# EAGLE design untitled B (EAGLE 6.2)
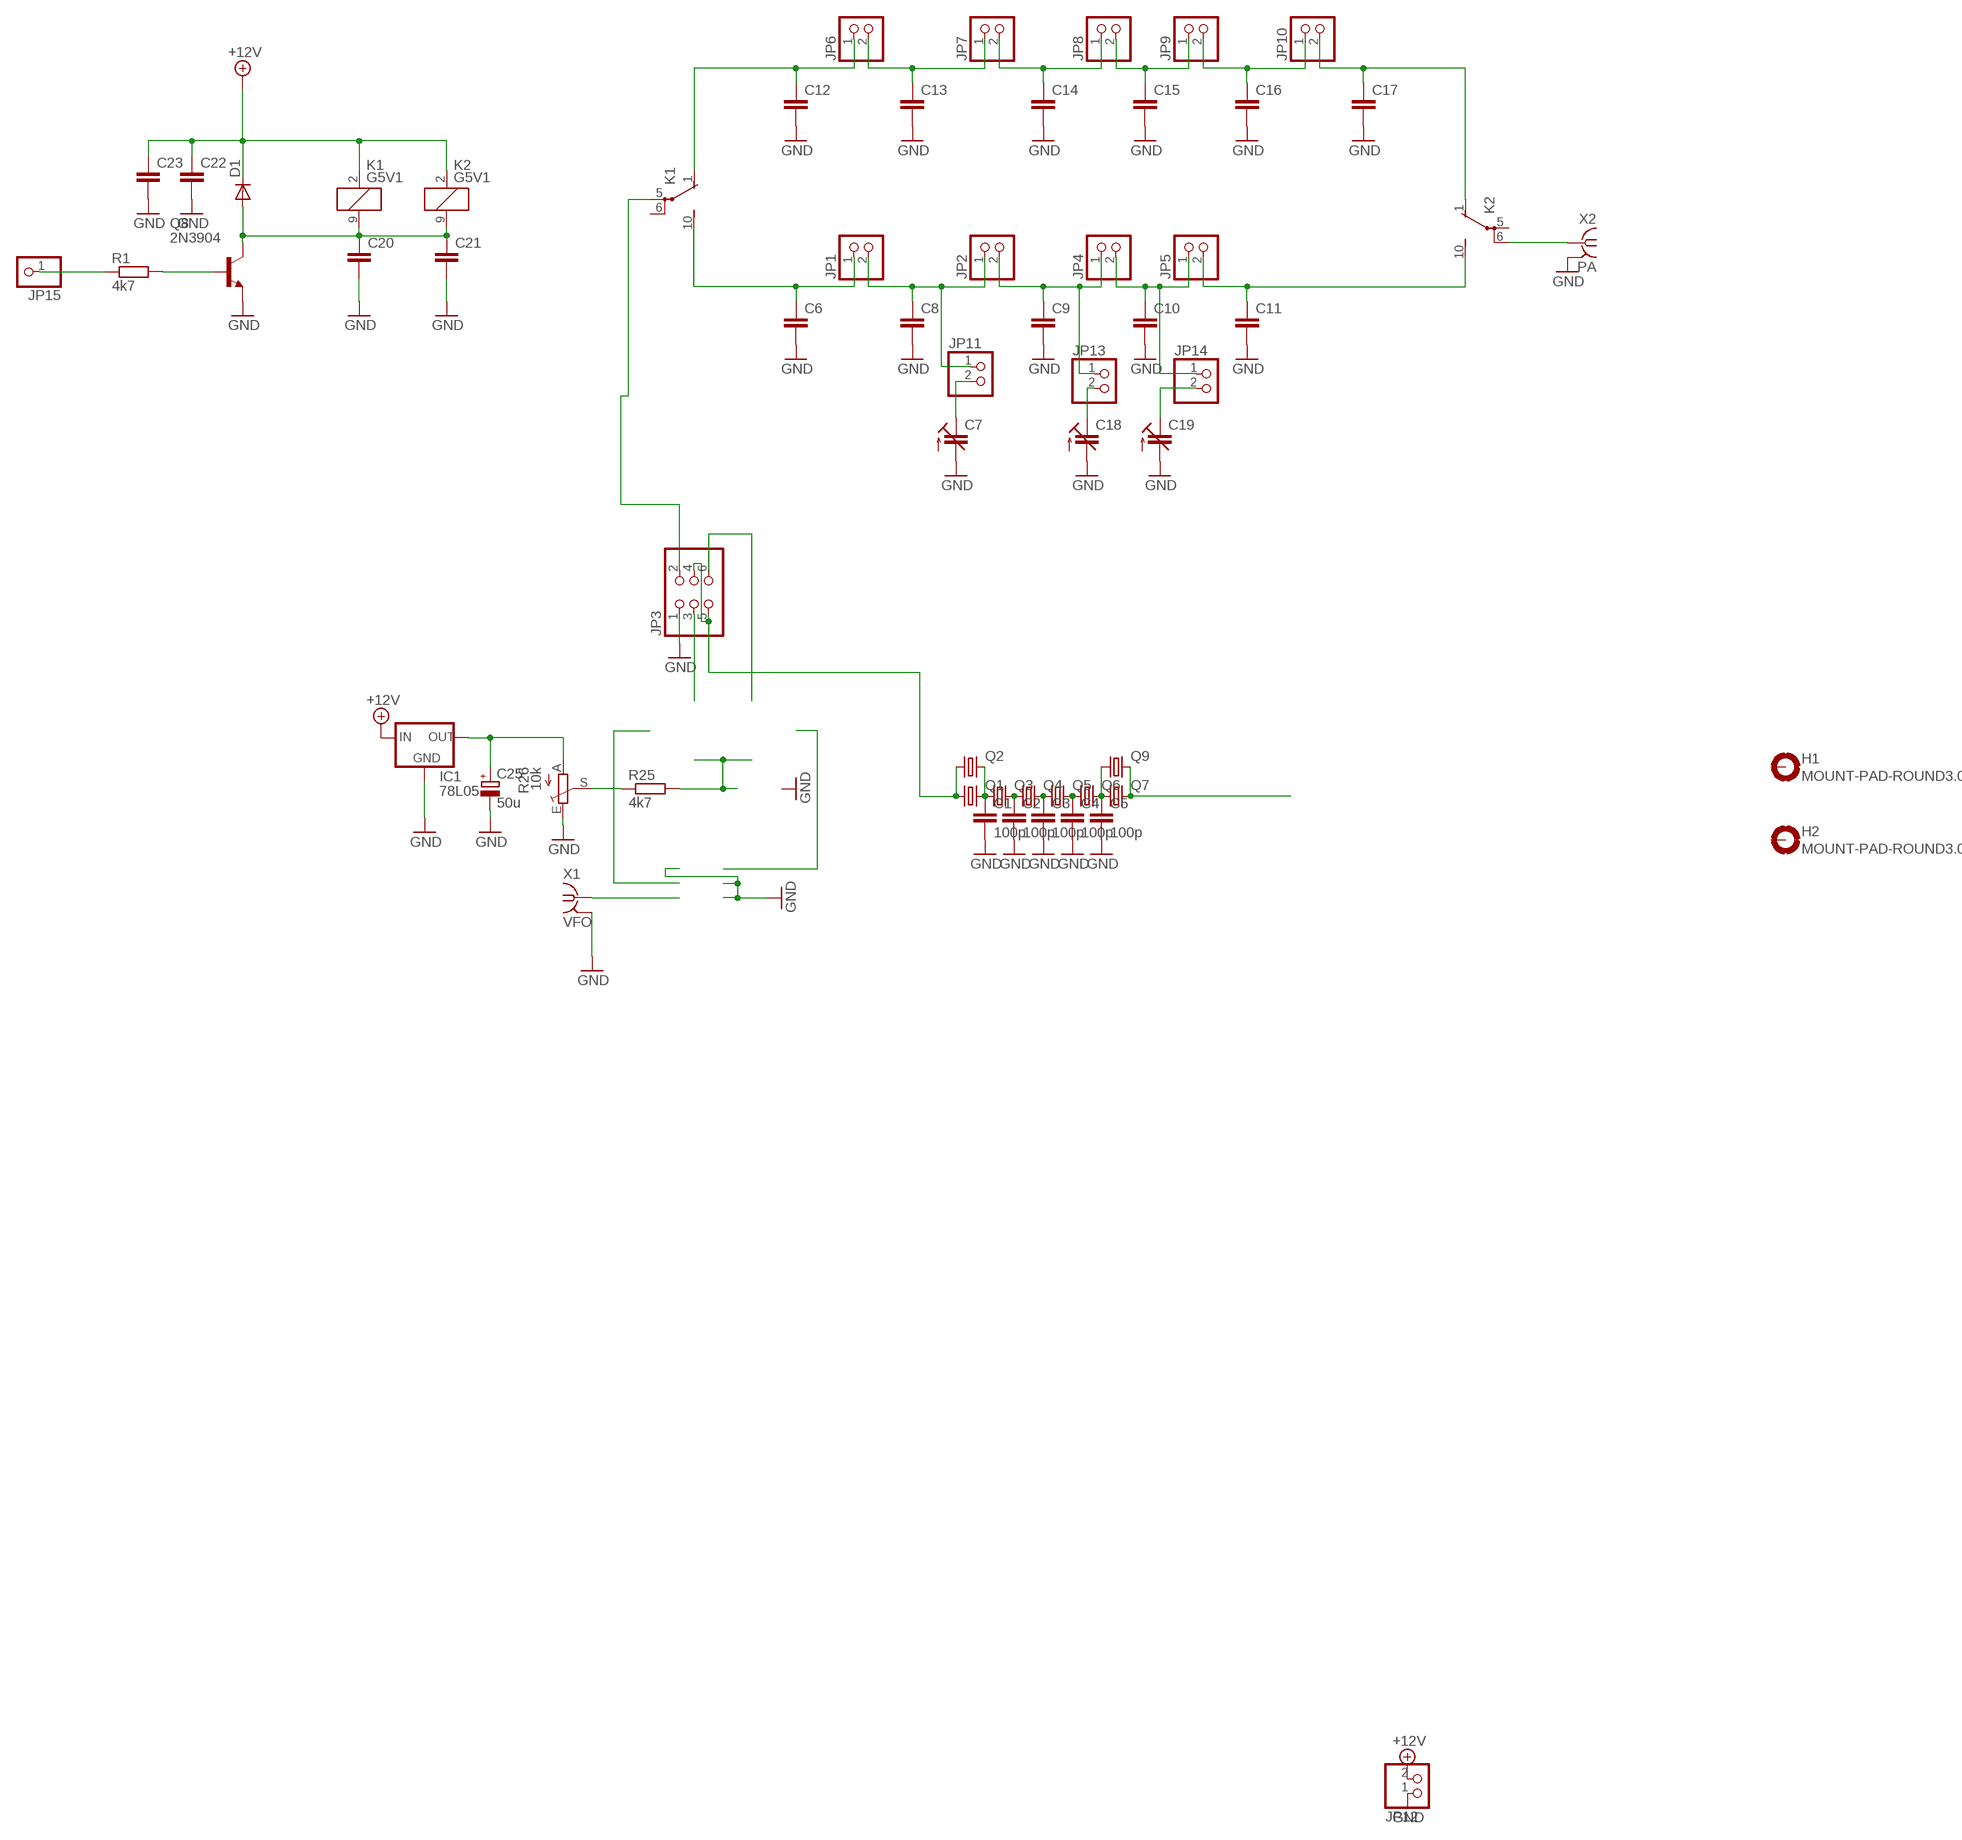
[diagram p0: schematic, sheet 1]

## Parts
C1  100p  C-EUC1206  [C1206]
C2  100p  C-EUC1206  [C1206]
C3  100p  C-EUC1206  [C1206]
C4  100p  C-EUC1206  [C1206]
C5  100p  C-EUC1206  [C1206]
C6  C-EU050-024X044  [C050-024X044]
C7  C-TRIMMTZ03  [CTRIMTZ03]
C8  C-EU050-024X044  [C050-024X044]
C9  C-EU050-024X044  [C050-024X044]
C10  C-EU050-024X044  [C050-024X044]
C11  C-EU050-024X044  [C050-024X044]
C12  C-EU050-024X044  [C050-024X044]
C13  C-EU050-024X044  [C050-024X044]
C14  C-EU050-024X044  [C050-024X044]
C15  C-EU050-024X044  [C050-024X044]
C16  C-EU050-024X044  [C050-024X044]
C17  C-EU050-024X044  [C050-024X044]
C18  C-TRIMMTZ03  [CTRIMTZ03]
C19  C-TRIMMTZ03  [CTRIMTZ03]
C20  C-EU050-024X044  [C050-024X044]
C21  C-EU050-024X044  [C050-024X044]
C22  C-EU050-024X044  [C050-024X044]
C23  C-EU050-024X044  [C050-024X044]
C25  50u  CPOL-EUE2.5-5  [E2,5-5]
D1  DIODE-D-5  [D-5]
H1  MOUNT-PAD-ROUND3.0  [3,0-PAD]
H2  MOUNT-PAD-ROUND3.0  [3,0-PAD]
IC1  78L05  78LXX  [78LXX]
JP1  PINHD-1X2  [1X02]
JP2  PINHD-1X2  [1X02]
JP3  PINHD-2X3  [2X03]
JP4  PINHD-1X2  [1X02]
JP5  PINHD-1X2  [1X02]
JP6  PINHD-1X2  [1X02]
JP7  PINHD-1X2  [1X02]
JP8  PINHD-1X2  [1X02]
JP9  PINHD-1X2  [1X02]
JP10  PINHD-1X2  [1X02]
JP11  PINHD-1X2  [1X02]
JP12  PINHD-1X2  [1X02]
JP13  PINHD-1X2  [1X02]
JP14  PINHD-1X2  [1X02]
JP15  PINHD-1X1  [1X01]
K1  G5V1  [G5V1]
K2  G5V1  [G5V1]
Q1  CRYSTALHC49S  [HC49/S]
Q2  CRYSTALHC49S  [HC49/S]
Q3  CRYSTALHC49S  [HC49/S]
Q4  CRYSTALHC49S  [HC49/S]
Q5  CRYSTALHC49S  [HC49/S]
Q6  CRYSTALHC49S  [HC49/S]
Q7  CRYSTALHC49S  [HC49/S]
Q8  2N3904  [TO92]
Q9  CRYSTALHC49S  [HC49/S]
R1  4k7  R-EU_0204/5  [0204/5]
R25  4k7  R-EU_0204/5  [0204/5]
R26  10k  TRIM_EU-CA6V  [CA6V]
X1  VFO  BU-SMA-V  [BU-SMA-V]
X2  PA  BU-SMA-V  [BU-SMA-V]

## Nets
+12V: C22.1 C23.1 D1.C IC1.IN JP12.2 K1.2 K2.2
GND: C1.2 C2.2 C3.2 C4.2 C5.2 C6.2 C7.2(A) C8.2 C9.2 C10.2 C11.2 C12.2 C13.2 C14.2 C15.2 C16.2 C17.2 C18.2(A) C19.2(A) C20.2 C21.2 C22.2 C23.2 C25.- IC1.GND JP3.1 JP12.1 Q8.3(E) R26.E X1.2(GND) X2.2(GND)
N$1: C1.1 Q1.2 Q2.2 Q3.1
N$2: C2.1 Q3.2 Q4.1
N$3: C3.1 Q4.2 Q5.1
N$4: C4.1 Q5.2 Q6.1
N$5: C5.1 Q6.2 Q7.1 Q9.1
N$6: C6.1 JP1.1 K1.10(2:S)
N$7: Q7.2 Q9.2
N$8: C8.1 JP1.2 JP2.1 JP11.1
N$9: C9.1 JP2.2 JP4.1 JP13.1
N$10: C10.1 JP4.2 JP5.1 JP14.1
N$11: C11.1 JP5.2 K2.10(2:S)
N$12: C12.1 JP6.1 K1.1(2:O)
N$13: C13.1 JP6.2 JP7.1
N$14: C14.1 JP7.2 JP8.1
N$15: C15.1 JP8.2 JP9.1
N$16: C16.1 JP9.2 JP10.1
N$17: C17.1 JP10.2 K2.1(2:O)
N$18: Q8.2(B) R1.2
N$19: K2.6(2:P) X2.1
N$20: JP3.2 K1.5(2:P)
N$21: C7.1(E) JP11.2
N$22: C18.1(E) JP13.2
N$23: C19.1(E) JP14.2
N$24: JP15.1 R1.1
N$25: C20.1 C21.1 D1.A K1.9 K2.9 Q8.1(C)
N$33: R25.1 R26.S
N$39: JP3.4 JP3.5 Q1.1 Q2.1
N$40: JP3.3
N$41: JP3.6
N$42: R25.2
N$46: X1.1
N$48: C25.+ IC1.OUT R26.A
Unconnected: H1.B3,0(MOUNT) H2.B3,0(MOUNT) K1.6(2:P) K2.5(2:P)

## Power pins joined to a net without a drawn wire
GND: X1.3(GND) X1.4(GND) X1.5(GND) X2.3(GND) X2.4(GND) X2.5(GND)

## Library data of the parts
C1-C6 C8-C17 C20-C23 = rcl:C-EU: CAPACITOR, European symbol
C7 C18 C19 = rcl:C-TRIMM: Trimm capacitor
C25 = rcl:CPOL-EU: POLARIZED CAPACITOR, European symbol
D1 = diode:DIODE-: DIODE
H1 H2 = holes:MOUNT-PAD-ROUND: MOUNTING PAD, round
IC1 = v-reg:78LXX: VOLTAGE REGULATOR
JP1 JP2 JP4-JP14 = pinhead:PINHD-1X2: PIN HEADER
JP3 = pinhead:PINHD-2X3: PIN HEADER
JP15 = pinhead:PINHD-1X1: PIN HEADER
K1 K2 = relay:G5V1: RELAY 1 x switch, 0.5 A/125 V AC, 1 A/24 V DC , Omron; MPN: G5V-1-DC24; OC_FARNELL: 9949593; OC_NEWARK: 36M6377
Q1-Q7 Q9 = crystal:CRYSTAL: CRYSTAL; OC_FARNELL: 1667008; OC_NEWARK: unknown
Q8 = transistor-npn:2N3904: NPN Transistor
R1 R25 = rcl:R-EU_: RESISTOR, European symbol
R26 = pot:TRIM_EU-: POTENTIOMETER
X1 X2 = con-coax:BU-SMA-V: FEMALE SMA CONNECTOR Radiall distributor RS 112-3794; OC_FARNELL: unknown; OC_NEWARK: unknown

## Board
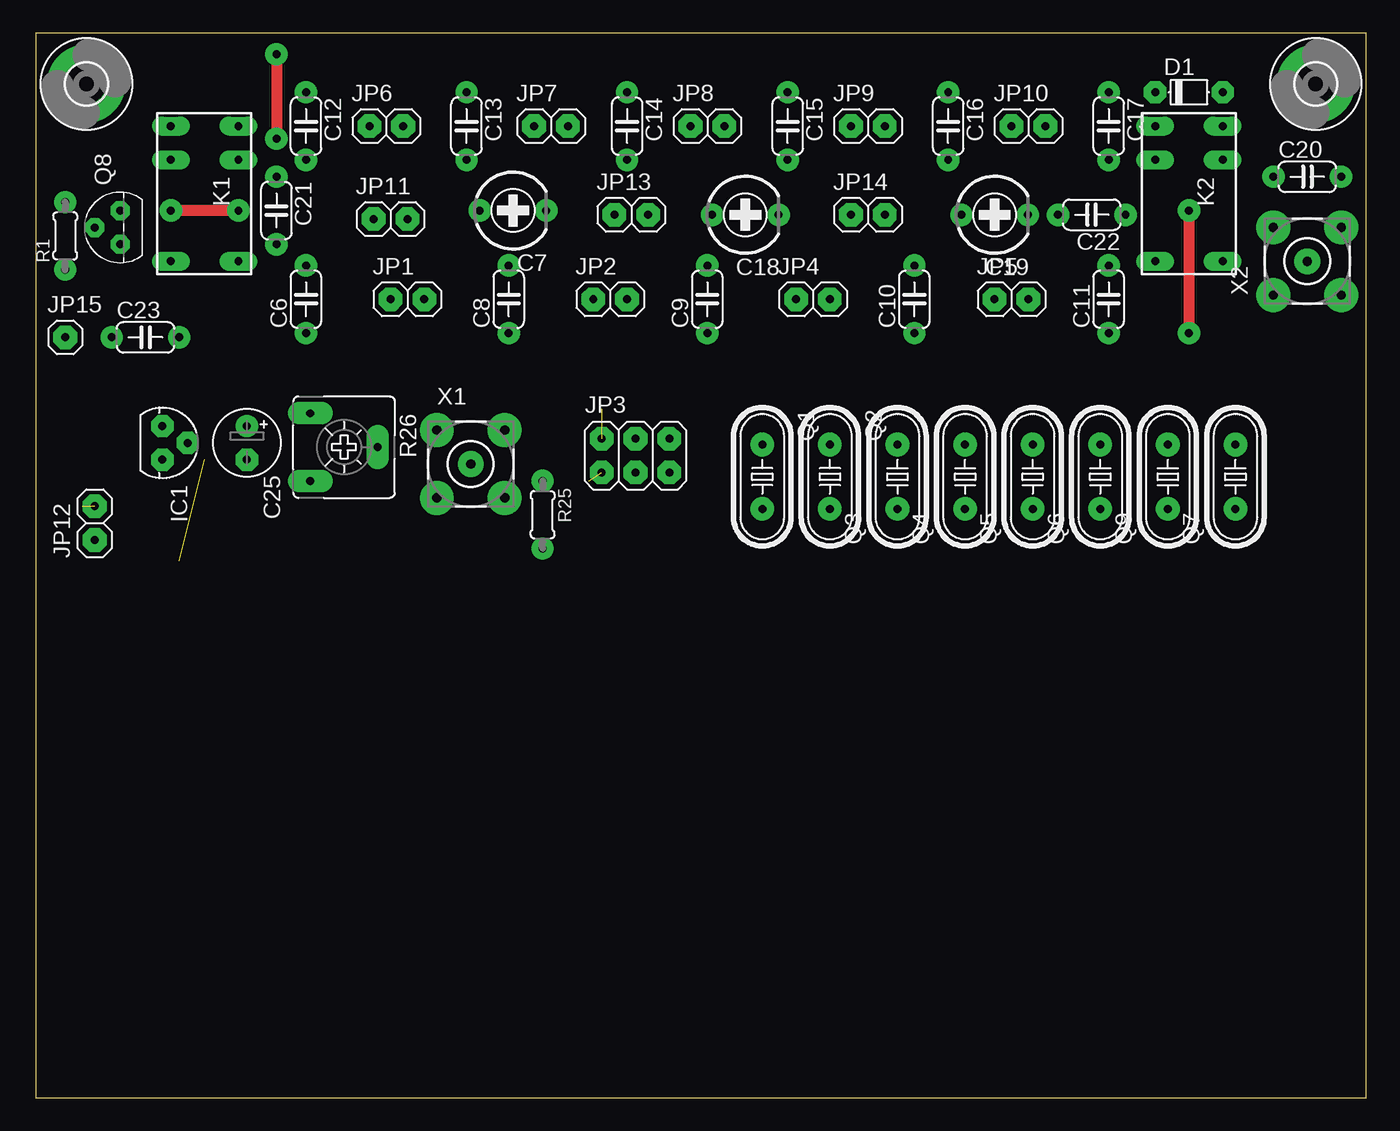
[diagram p1: board, top side]
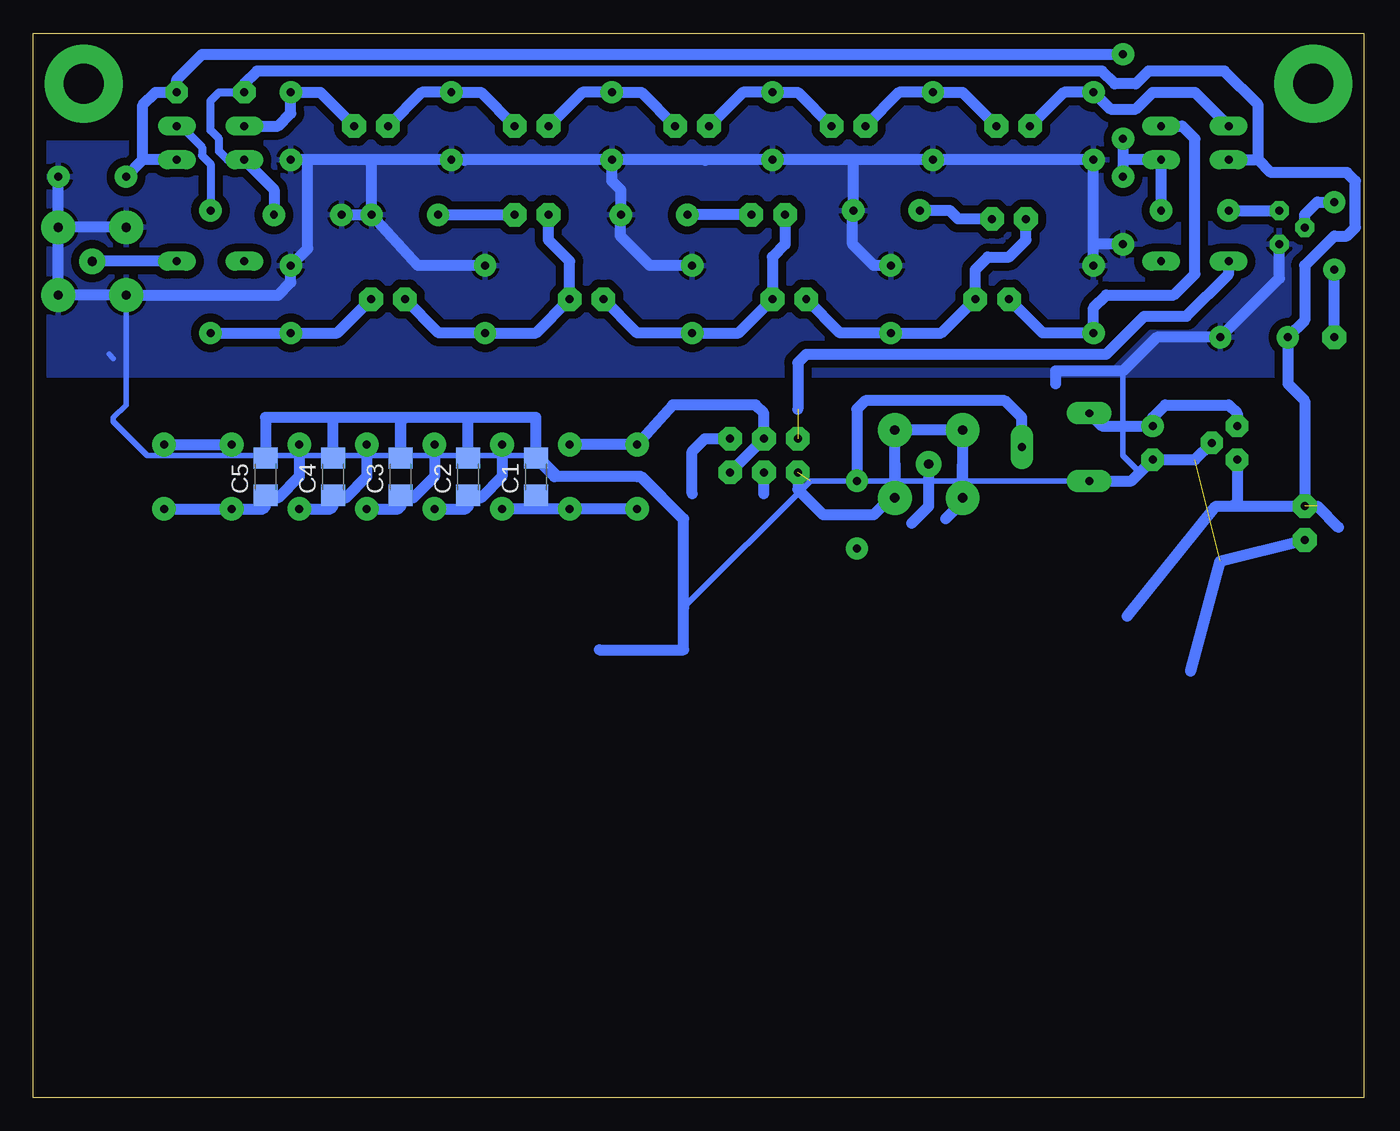
[diagram p2: board, bottom side, seen from below]

Size 100 x 80 mm. Coordinates in mm from the lower left corner, seen from the top.
Outline: 0,0 100,0 100,80 0,80 0,54.29 0,0
Copper layers (1*16): Top 0.035mm / dielectric 1.5mm / Bottom 0.035mm
Design rules: minimum track width 10mil, minimum drill 24mil, track to track 8mil, track to pad 8mil, pad to pad 8mil, via to via 8mil, smd to smd 8mil, copper to edge 40mil, drill to drill 8mil, minimum pad ring 10mil, minimum via ring 8mil, stop-mask expansion 4mil, vias tented up to drill 0mil, thermal gap 10mil

### Footprints (pad centres in the part's own frame; a part is rotated, then mirrored left to right if it is on the bottom)
C1206 = smd 1.6 x 1.8: 1 -1.4,0; 2 1.4,0
C050-024X044 = drill 0.6 pad 1.676: 1 -2.54,0; 2 2.54,0
CTRIMTZ03 = drill 0.6 pad 1.676: 1 0,2.5; 2 0,-2.5
E2,5-5 = drill 0.6 pad 1.676: + -1.27,0 | drill 0.6 pad 1.676 octagon: - 1.27,0
D-5 = drill 0.6 pad 1.676 octagon: A 2.54,0; C -2.54,0
3,0-PAD = drill 3 pad 5.842: B3,0 0,0
78LXX = drill 0.6 pad 1.676 octagon: GND 0,1.905; IN 1.27,0; OUT -1.27,0
1X02 = drill 0.6 pad 1.778 octagon: 1 -1.27,0; 2 1.27,0
2X03 = drill 0.6 pad 1.778 octagon: 1 -2.54,-1.27; 2 -2.54,1.27; 3 0,-1.27; 4 0,1.27; 5 2.54,-1.27; 6 2.54,1.27
1X01 = drill 0.6 pad 1.778 octagon: 1 0,0
G5V1 = drill 0.6 pad 1.422 long: 1 -5.08,-2.54; 2 -2.54,-2.54; 5 5.08,-2.54; 6 5.08,2.54; 9 -2.54,2.54; 10 -5.08,2.54
HC49/S = drill 0.6 pad 1.778: 1 -2.413,0; 2 2.413,0
TO92 = drill 0.6 pad 1.422 octagon: 1 1.27,0; 2 0,1.905; 3 -1.27,0
0204/5 = drill 0.6 pad 1.676: 1 -2.54,0; 2 2.54,0
CA6V = drill 0.6 pad 1.676 long: A -2.54,-2.54; E 2.54,-2.54; S 0,2.54
BU-SMA-V = drill 0.7 pad 1.93: 1 0,0 | drill 0.7 pad 2.54: 2 -2.55,2.55; 3 2.55,2.55; 4 2.55,-2.55; 5 -2.55,-2.55

### Placement (x,y rotation side)
C1  62.23,46.67 90 bottom
C2  67.31,46.67 90 bottom
C3  72.39,46.67 90 bottom
C4  77.47,46.67 90 bottom
C5  82.55,46.67 90 bottom
C6  20.32,60.01 90 top
C7  35.88,66.67 90 top
C8  35.56,60.01 90 top
C9  50.48,60.01 90 top
C10  66.04,60.01 90 top
C11  80.64,60.01 90 top
C12  20.32,73.03 270 top
C13  32.38,73.03 270 top
C14  44.45,73.03 270 top
C15  56.52,73.03 270 top
C16  68.58,73.03 270 top
C17  80.64,73.03 270 top
C18  53.34,66.36 90 top
C19  72.07,66.36 90 top
C20  95.57,69.22 0 top
C21  18.1,66.67 270 top
C22  79.38,66.36 180 top
C23  8.26,57.15 0 top
C25  15.88,49.21 270 top
D1  86.68,75.56 0 top
H1  3.81,76.2 0 top
H2  96.2,76.2 0 top
IC1  9.53,49.21 270 top
JP1  27.94,60.01 0 top
JP2  43.18,60.01 0 top
JP3  45.09,48.26 0 top
JP4  58.42,60.01 0 top
JP5  73.34,60.01 0 top
JP6  26.35,73.03 0 top
JP7  38.73,73.03 0 top
JP8  50.48,73.03 0 top
JP9  62.55,73.03 0 top
JP10  74.61,73.03 0 top
JP11  26.67,66.04 0 top
JP12  4.45,43.18 90 top
JP13  44.77,66.36 0 top
JP14  62.55,66.36 0 top
JP15  2.22,57.15 0 top
K1  12.7,67.94 270 top
K2  86.68,67.94 270 top
Q1  54.61,46.67 270 top
Q2  59.69,46.67 270 top
Q3  64.77,46.67 90 top
Q4  69.85,46.67 90 top
Q5  74.93,46.67 90 top
Q6  80.01,46.67 90 top
Q7  90.17,46.67 90 top
Q8  6.35,65.41 90 top
Q9  85.09,46.67 90 top
R1  2.22,64.77 90 top
R25  38.1,43.81 270 top
R26  23.18,48.9 270 top
X1  32.7,47.62 0 top
X2  95.57,62.87 90 top

### Tracks (layer width: path | path; a pad name or v marks a point on that pad's centre or on a via)
+12V  (1 unrouted)
  Bottom 0.61: K2.2 85.41,70.48 86.04,71.12 86.04,72.07 86.68,72.71 86.68,74.93 86.04,75.56 D1.C
  Bottom 0.813: 3.49,44.45 1.91,42.86 | 17.78,36.2 11.11,44.45 9.84,44.45 | 9.84,44.45 JP12.2 4.45,52.39 5.71,53.66 C23.1 4.45,58.42 4.45,62.55 2.22,64.77 1.27,64.77 0.64,65.41 0.64,68.9 1.27,69.53 6.99,69.53 7.94,70.48 | 9.84,44.45 9.53,44.77 IC1.IN | D1.C 84.14,76.2 83.19,77.15 19.68,77.15 18.73,76.2 17.14,76.2 16.19,77.15 10.48,77.15 7.94,74.61 7.94,70.48 | K2.2 81.92,68.26 C22.1 | K1.2 7.94,70.48
GND  (2 unrouted)
  Bottom 0.406: 51.12,43.5 51.44,43.5 54.61,46.67 60.33,46.67 61.91,48.26 91.44,48.26 93.98,50.8 93.98,51.12 93.03,52.07 93.03,60.3 X2.2 | 93.98,55.56 94.3,55.88 | 18.1,54.61 18.1,48.26 16.83,46.99 | R26.E 41.59,46.35 51.12,36.83
  Bottom 0.813: 31.43,43.5 30.16,44.77 30.16,47.6 X1.5 | JP3.1 42.55,45.72 40.64,43.81 36.83,43.81 35.24,45.4 35.24,47.6 X1.4 X1.3 30.16,50.16 30.15,50.16 | X1.5 30.15,50.16 | 30.15,50.16 X1.2 | 30.14,46.35 X1.5 | 57.47,33.66 51.12,33.66 51.12,36.83 51.12,43.5 54.29,46.67 54.61,46.67 60.83,46.67 C1.2 62.23,51.12 67.31,51.12 | C2.2 67.31,51.12 | 67.31,51.12 72.07,51.12 | 72.07,51.12 72.39,51.12 | 72.39,51.12 C3.2 72.39,50.8 72.07,51.12 | 72.39,51.12 77.47,51.12 | C4.2 77.47,51.12 | 77.47,51.12 82.55,51.12 C5.2 | R26.E 17.46,46.35 16.83,46.99 C25.- 12.7,47.94 IC1.GND | 13.02,32.07 10.79,40.32 JP12.1 | C13.2 C12.2 20.32,64.14 | C13.2 31.75,70.48 31.71,70.44 | C13.2 38.42,70.48 | 38.42,70.48 C14.2 49.53,70.48 | 49.53,70.48 C15.2 | C15.2 67.63,70.48 | 67.63,70.48 C16.2 74.93,70.48 | 74.93,70.48 79.38,70.48 | 79.38,70.48 C17.2 | C6.2 20.32,64.14 | 49.49,70.44 49.53,70.48 | 67.59,70.44 67.63,70.48 | C19.2 74.57,70.44 74.93,70.48 | C10.2 71.08,62.55 C19.2 | C9.2 53.66,62.55 55.88,64.77 55.88,66.32 C18.2 55.84,68.22 56.52,68.9 C15.2 | C8.2 36.83,62.55 38.42,64.14 38.42,66.64 C7.2 38.38,70.44 38.42,70.48 | X2.4 X2.3 93.01,65.41 | X2.4 X2.5 X2.2 81.61,60.31 80.64,61.28 C11.2 79.38,63.82 79.38,70.48 | X2.4 98.12,69.2 C20.2 | C22.2 C19.2 | C21.2 20.32,64.14 | 23.18,53.66 23.18,54.61 18.1,54.61 15.56,57.15 C23.2 6.35,61.59 Q8.3
  pour Bottom (isolate 0.61): 0.32,54.29 99.69,54.29 99.69,55.56 99.69,71.75 92.71,71.75 92.71,72.07 92.71,74.3 87.95,79.06 10.79,79.06 0.32,68.58
N$1
  Bottom 0.813: Q1.2 Q2.2 62.23,44.26 | 62.23,44.26 Q3.1 | C1.1 62.23,44.26
N$2
  Bottom 0.813: Q4.1 67.5,44.26 67.31,44.45 C2.1 67.12,45.09 66.36,45.09 64.77,46.67 Q3.2
N$3
  Bottom 0.813: Q4.2 69.85,46.67 71.44,45.09 72.2,45.09 C3.1 72.39,44.45 72.58,44.26 Q5.1
N$4
  Bottom 0.813: Q6.1 77.66,44.26 77.47,44.45 C4.1 77.28,45.09 76.52,45.09 74.93,46.67 Q5.2
N$5
  Bottom 0.813: Q7.1 Q9.1 82.74,44.26 82.55,44.45 C5.1 82.36,45.09 81.6,45.09 80.01,46.67 Q6.2
N$6
  Bottom 0.813: JP1.1 24.13,57.47 C6.1 20.32,59.37 19.37,60.33 14.29,60.33 12.7,61.91 12.7,72.07 13.65,73.03 K1.10
N$7
  Bottom 0.813: Q7.2 Q9.2
N$8
  Bottom 0.813: JP11.1 25.4,64.45 26.67,63.18 28.26,63.18 29.21,62.23 JP1.2 31.75,57.47 C8.1 39.37,57.47 JP2.1
N$9
  Bottom 0.813: JP4.1 54.61,57.47 C9.1 46.99,57.47 JP2.2 44.45,63.18 43.5,64.14 JP13.1
N$10
  Bottom 0.813: JP5.1 69.53,57.47 C10.1 62.23,57.47 JP4.2 59.69,62.87 61.28,64.45 JP14.1
N$11  (via drill 0.6 pad 1.68)
  Top 0.813: v86.68,66.67 v86.68,57.47
  Bottom 0.61: K2.10 88.9,73.03 87.31,71.44 87.31,70.8 86.68,70.17 v86.68,66.67
  Bottom 0.813: JP5.2 77.15,57.47 C11.1 v86.68,57.47
N$12
  Bottom 0.813: JP6.1 22.54,75.56 C12.1 19.05,74.3 17.14,74.3 15.88,75.56 12.7,75.56 K1.1
N$13
  Bottom 0.813: JP6.2 30.16,75.56 C13.1 34.92,75.56 JP7.1
N$14
  Bottom 0.813: JP7.2 42.55,75.56 C14.1 46.67,75.56 JP8.1
N$15
  Bottom 0.813: JP8.2 54.29,75.56 C15.1 58.74,75.56 JP9.1
N$16
  Bottom 0.813: JP9.2 66.36,75.56 C16.1 70.8,75.56 JP10.1
N$17
  Bottom 0.813: JP10.2 78.42,75.56 C17.1 80.64,73.98 81.6,73.03 K2.1
N$18
  Bottom 0.813: Q8.2 4.45,66.36 3.49,67.31 R1.2
N$19
  Bottom 0.813: K2.6 X2.1
N$20  (1 unrouted)
  Bottom 0.813: 42.55,51.75 42.55,55.24 41.91,55.88 19.37,55.88 16.51,58.74 13.34,58.74 10.16,61.91 K1.5
N$21
  Bottom 0.813: JP11.2 30.48,66.04 31.11,66.67 C7.1
N$22
  Bottom 0.813: JP13.2 C18.1
N$23
  Bottom 0.813: C19.1 JP14.2
N$24
  Bottom 0.813: JP15.1 R1.1
N$25  (via drill 0.6 pad 1.68)
  Top 0.813: v15.24,66.67 v10.16,66.67 | v18.1,78.42 v18.1,72.07
  Bottom 0.813: K2.9 91.76,70.48 | 91.76,70.48 91.76,74.61 90.81,75.56 D1.A 89.22,76.52 87.31,78.42 v18.1,78.42 | C20.1 91.76,70.48 | v15.24,66.67 K1.9 18.1,70.48 | v10.16,66.67 Q8.1 | v18.1,72.07 18.1,70.48 | 18.1,70.48 C21.1
N$33
  Bottom 0.813: R26.S 25.72,51.12 26.99,52.39 37.47,52.39 38.1,51.75 R25.1
N$39
  Bottom 0.813: JP3.5 JP3.4 45.09,51.44 45.72,52.07 51.94,52.07 Q1.1 Q2.1
N$40
  Bottom 0.813: 45.09,45.4 JP3.3
N$41
  Bottom 0.813: 50.48,45.4 50.48,48.58 49.53,49.53 JP3.6
N$46
  Bottom 0.813: 33.97,43.18 32.7,44.45 X1.1
N$48
  Bottom 0.813: R26.A 19.68,50.48 C25.+ 15.88,51.12 14.92,52.07 10.16,52.07 9.53,51.44 IC1.OUT